# EAGLE design ATMEGA328P (EAGLE 9.5.2)
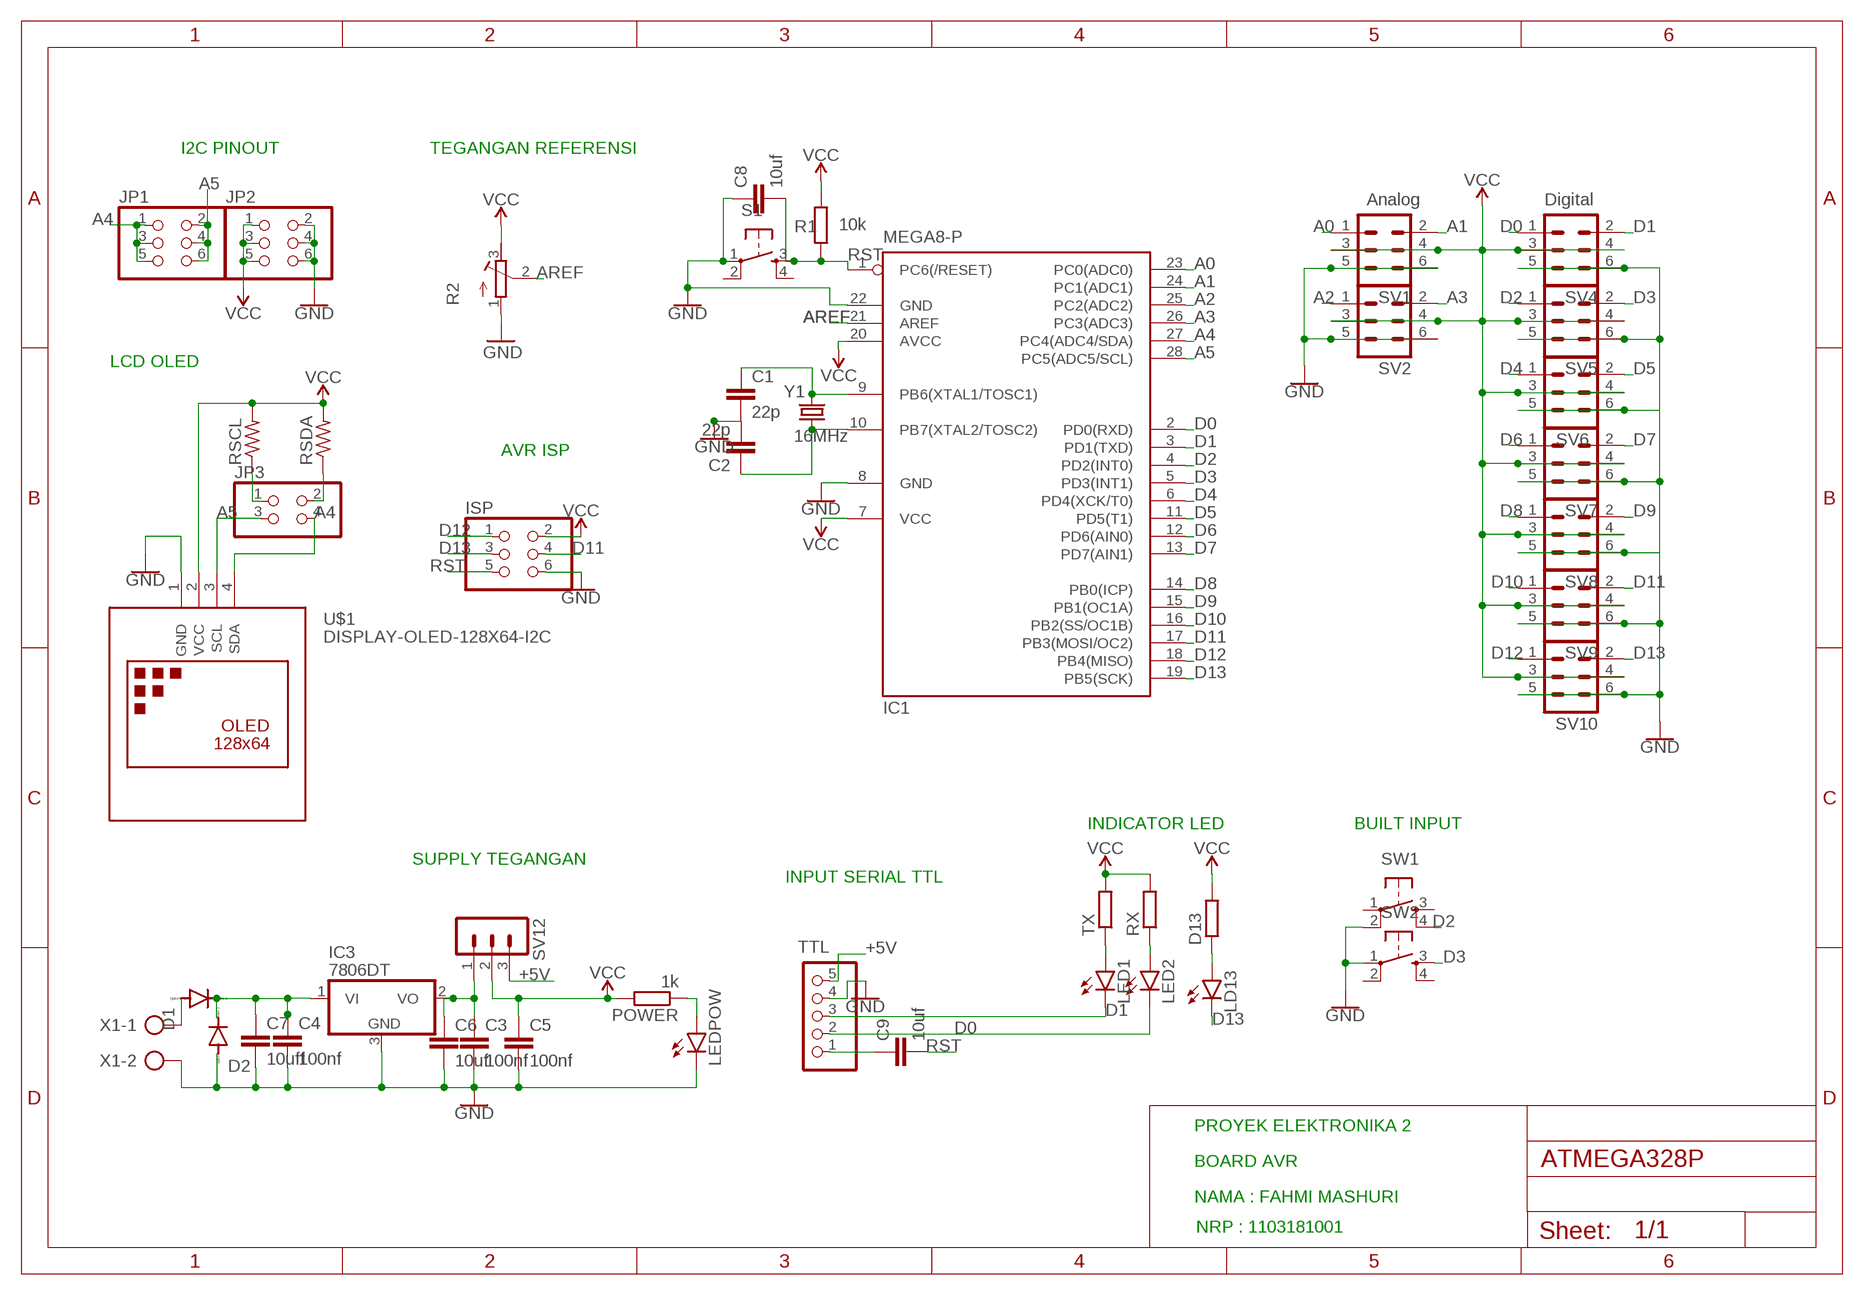
[diagram p0: schematic, sheet 1]

## Parts
C1  22p  C-EUC0805K  [C0805K]
C2  22p  C-EUC0805K  [C0805K]
C3  100nf  C-EUC0805K  [C0805K]
C4  100nf  C-EUC0805K  [C0805K]
C5  100nf  C-EUC0805K  [C0805K]
C6  10uf  C-EUC0805K  [C0805K]
C7  10uff  C-EUC0805K  [C0805K]
C8  10uf  C-EUC0805K  [C0805K]
C9  10uf  C-EUC0805K  [C0805K]
D1  PURPLE  PMLL4150  [SOD80C]
D2  PURPLE  PMLL4150  [SOD80C]
D13  R-EU_R0805  [R0805]
IC1  MEGA8-P  [DIL28-3]
IC3  7806DT  [TO252]
ISP  PINHD-2X3  [2X03]
JP1  PINHD-2X3  [2X03]
JP2  PINHD-2X3  [2X03]
JP3  PINHD-2X2  [2X02]
LD13  LED3MM  [LED3MM]
LED1  LED3MM  [LED3MM]
LED2  LED3MM  [LED3MM]
LEDPOW  LED3MM  [LED3MM]
POWER  1k  R-EU_R0805  [R0805]
R1  10k  R-EU_R0805  [R0805]
R2  R-TRIMM64W  [RTRIM64W]
RSCL  R-US_R1206  [R1206]
RSDA  R-US_R1206  [R1206]
RX  R-EU_R0805  [R0805]
S1  TAC_SWITCHPTH  [TACTILE-PTH]
SV1  MA03-2  [MA03-2]
SV2  MA03-2  [MA03-2]
SV4  MA03-2  [MA03-2]
SV5  MA03-2  [MA03-2]
SV6  MA03-2  [MA03-2]
SV7  MA03-2  [MA03-2]
SV8  MA03-2  [MA03-2]
SV9  MA03-2  [MA03-2]
SV10  MA03-2  [MA03-2]
SV12  MA03-1  [MA03-1]
SW1  TAC_SWITCHPTH  [TACTILE-PTH]
SW2  TAC_SWITCHPTH  [TACTILE-PTH]
TTL  PINHD-1X5  [1X05]
TX  R-EU_R0805  [R0805]
U$1  DISPLAY-OLED-128X64-I2C  [DISPLAY-OLED-128X64-I2C]
X1  AK500/2-H  [AK500/2-H]
Y1  16MHz  CRYSTALSMD-HC49UP  [HC49UP]

## Nets
+5V: SV12.3 TTL.5
A0: IC1.23(PC0(ADC0)) SV1.1
A1: IC1.24(PC1(ADC1)) SV1.2
A2: IC1.25(PC2(ADC2)) SV2.1
A3: IC1.26(PC3(ADC3)) SV2.2
A4: IC1.27(PC4(ADC4/SDA)) JP1.1 JP1.3 JP1.5 JP3.4 U$1.4(SDA)
A5: IC1.28(PC5(ADC5/SCL)) JP1.2 JP1.4 JP1.6 JP3.3 U$1.3(SCL)
AREF: IC1.21(AREF) R2.2(S)
D0: IC1.2(PD0(RXD)) LED2.K(C) SV4.1 TTL.2
D1: IC1.3(PD1(TXD)) LED1.K(C) SV4.2 TTL.3
D2: IC1.4(PD2(INT0)) SV5.1 SW1.4
D3: IC1.5(PD3(INT1)) SV5.2 SW2.3
D4: IC1.6(PD4(XCK/T0)) SV6.1
D5: IC1.11(PD5(T1)) SV6.2
D6: IC1.12(PD6(AIN0)) SV7.1
D7: IC1.13(PD7(AIN1)) SV7.2
D8: IC1.14(PB0(ICP)) SV8.1
D9: IC1.15(PB1(OC1A)) SV8.2
D10: IC1.16(PB2(SS/OC1B)) SV9.1
D11: IC1.17(PB3(MOSI/OC2)) ISP.4 SV9.2
D12: IC1.18(PB4(MISO)) ISP.1 SV10.1
D13: IC1.19(PB5(SCK)) ISP.3 LD13.K(C) SV10.2
GND: C1.2 C2.2 C3.2 C4.2 C5.2 C6.2 C7.2 C8.1 D2.A IC1.8(GND) IC1.22(GND) IC3.3(GND) ISP.6 JP2.2 JP2.4 JP2.6 LEDPOW.K(C) R2.1(A) S1.1 SV1.5 SV1.6 SV2.5 SV2.6 SV4.5 SV4.6 SV5.5 SV5.6 SV6.5 SV6.6 SV7.5 SV7.6 SV8.5 SV8.6 SV9.5 SV9.6 SV10.5 SV10.6 SW1.2 SW2.1 TTL.4 U$1.1(GND) X1.2
N$1: D13.1 LD13.A
N$2: C9.1 TTL.1
N$3: JP3.1 RSCL.1
N$4: JP3.2 RSDA.1
N$5: C1.1 IC1.9(PB6(XTAL1/TOSC1)) Y1.2
N$6: C2.1 IC1.10(PB7(XTAL2/TOSC2)) Y1.1
N$7: D1.A X1.1
N$8: C4.1 C7.1 D1.C D2.C IC3.1(VI)
N$10: LED1.A TX.1
N$11: LED2.A RX.1
N$12: C3.1 C6.1 IC3.2(VO) SV12.1
N$14: LEDPOW.A POWER.1
RST: C8.2 C9.2 IC1.1(PC6(/RESET)) ISP.5 R1.1 S1.3
VCC: C5.1 D13.2 IC1.7(VCC) IC1.20(AVCC) ISP.2 JP2.1 JP2.3 JP2.5 POWER.2 R1.2 R2.3(E) RSCL.2 RSDA.2 RX.2 SV1.3 SV1.4 SV2.3 SV2.4 SV4.3 SV4.4 SV5.3 SV5.4 SV6.3 SV6.4 SV7.3 SV7.4 SV8.3 SV8.4 SV9.3 SV9.4 SV10.3 SV10.4 SV12.2 TX.2 U$1.2(VCC)
Unconnected: S1.2 S1.4 SW1.1 SW1.3 SW2.2 SW2.4

## Notes on the sheet
- I2C PINOUT | TEGANGAN REFERENSI
- Analog | Digital
- LCD OLED
- AVR ISP
- INDICATOR LED | BUILT INPUT
- SUPPLY TEGANGAN
- INPUT SERIAL TTL
- PROYEK ELEKTRONIKA 2
- BOARD AVR
- NAMA : FAHMI MASHURI
- NRP : 1103181001

## Library data of the parts
C1-C9 = rcl:C-EU: CAPACITOR, European symbol; SPICEPREFIX: C
D1 D2 = diode:PMLL4150: DIODE high speed
D13 POWER R1 RX TX = rcl:R-EU_: RESISTOR, European symbol; SPICEPREFIX: R
IC1 = atmel:MEGA8-P: MICROCONTROLLER 8 Kbytes FLASH, 1 kbytes SRAM, 512 bytes EEPROM, USART, 4-channel 10 bit ADC, 2-channel 8 bit ADC Pin compatible with Atmega48, ATMega88, ATMega168 Source: avr.lbr; OC_FARNELL: unknown; OC_NEWARK: unknown
IC3 = linear:78*: Positive VOLTAGE REGULATOR Source: http://cache.national.com/ds/LM/LM78L05.pdf http://www.fairchildsemi.com/ds/LM/LM7805.pdf
ISP JP1 JP2 = pinhead:PINHD-2X3: PIN HEADER
JP3 = pinhead:PINHD-2X2: PIN HEADER
LD13 LED1 LED2 LEDPOW = led:LED: LED OSRAM: - CHIPLED LG R971, LG N971, LY N971, LG Q971, LY Q971, LO R971, LY R971 LH N974, LH R974 LS Q976, LO Q976, LY Q976 LO Q996 - Hyper CHIPLED LW Q18S LB Q993, LB Q99A, LB R99A - SideLED LS A670, LO A670, LY A670, LG A670, LP A670 LB A673, LV A673, LT A673, LW A673 LH A674 LY A675 LS A676, LA A676, LO A676, LY A676, LW A676 LS A679, LY A679, LG A679 - Hyper Micro SIDELED® LS Y876, LA Y876, LO Y876, LY Y876 LT Y87S - SmartLED LW L88C, LW L88S LB L89C, LB L89S, LG L890 LS L89K, LO L89K, LY L89K LS L896, LA L896, LO L896, LY L896 - TOPLED LS T670, LO T670, LY T670, LG T670, LP T670 LSG T670, LSP T670, LSY T670, LOP T670, LYG T670 LG T671, LOG T671, LSG T671 LB T673, LV T673, LT T673, LW T673 LH T674 LS T676, LA T676, LO T676, LY T676, LB T676, LH T676, LSB T676, LW T676 LB T67C, LV T67C, LT T67C, LS T67K, LO T67K, LY T67K, LW E67C LS E67B, LA E67B, LO E67B, LY E67B, LB E67C, LV E67C, LT E67C LW T67C LS T679, LY T679, LG T679 LS T770, LO T770, LY T770, LG T770, LP T770 LB T773, LV T773, LT T773, LW T773 LH T774 LS E675, LA E675, LY E675, LS T675 LS T776, LA T776, LO T776, LY T776, LB T776 LHGB T686 LT T68C, LB T68C - Hyper Mini TOPLED® LB M676 - Mini TOPLED Santana® LG M470 LS M47K, LO M47K, LY M47K Source: http://www.osram.convergy.de LUXEON: - LUMILED® LXK2-PW12-R00, LXK2-PW12-S00, LXK2-PW14-U00, LXK2-PW14-V00 LXK2-PM12-R00, LXK2-PM12-S00, LXK2-PM14-U00 LXK2-PE12-Q00, LXK2-PE12-R00, LXK2-PE12-S00, LXK2-PE14-T00, LXK2-PE14-U00 LXK2-PB12-K00, LXK2-PB12-L00, LXK2-PB12-M00, LXK2-PB14-N00, LXK2-PB14-P00, LXK2-PB14-Q00 LXK2-PR12-L00, LXK2-PR12-M00, LXK2-PR14-Q00, LXK2-PR14-R00 LXK2-PD12-Q00, LXK2-PD12-R00, LXK2-PD12-S00 LXK2-PH12-R00, LXK2-PH12-S00 LXK2-PL12-P00, LXK2-PL12-Q00, LXK2-PL12-R00 Source: www.luxeon.com KINGBRIGHT: KA-3528ASYC Source: www.kingbright.com
R2 = rcl:R-TRIMM: Trimm resistor; SPICEMODEL: X; SPICEPREFIXL: POT
RSCL RSDA = rcl:R-US_: RESISTOR, American symbol; SPICEPREFIX: R
S1 SW1 SW2 = SparkFun-Retired:TAC_SWITCH: Momentary Switch Button commonly used for reset or general input. Spark Fun Electronics SKU : COM-00097 SMT- SWCH-08247
SV1 SV2 SV4-SV10 = con-lstb:MA03-2: PIN HEADER; OC_FARNELL: unknown; OC_NEWARK: unknown
SV12 = con-lstb:MA03-1: PIN HEADER; OC_FARNELL: unknown; OC_NEWARK: unknown
TTL = pinhead:PINHD-1X5: PIN HEADER
U$1 = oled lcd:DISPLAY-OLED-128X64-I2C: 128x64 Dot Matrix OLED Module based on SSD1306 chip Variant with I2C interface More details available here: http://www.instructables.com/id/Monochrome-096-i2c-OLED-display-with-arduino-SSD13/ SSD1306 datasheet: https://cdn-shop.adafruit.com/datasheets/SSD1306.pdf Click here to find device on ebay.com <http://www.ebay.com/sch/oled+display+128x64+iic> Note: There are two variants: I2C and SPI. Search for the proper version.
X1 = con-ptr500:AK500/2-H: CONNECTOR Aug. 2004 / PTR Meßtechnik: Die Bezeichnung der Serie AK505 wurde geändert. Es handelt sich hierbei um AK500 in horizontaler Ausführung.; OC_FARNELL: unknown; OC_NEWARK: unknown
Y1 = SparkFun-Clocks:CRYSTAL: Crystals (Generic) These are passive quartz crystals, which can be used as a clock source for a microcontroller. Crystal's are two-terminal devices. They require external "load" capacitors to generate an oscillating signal.

## Board
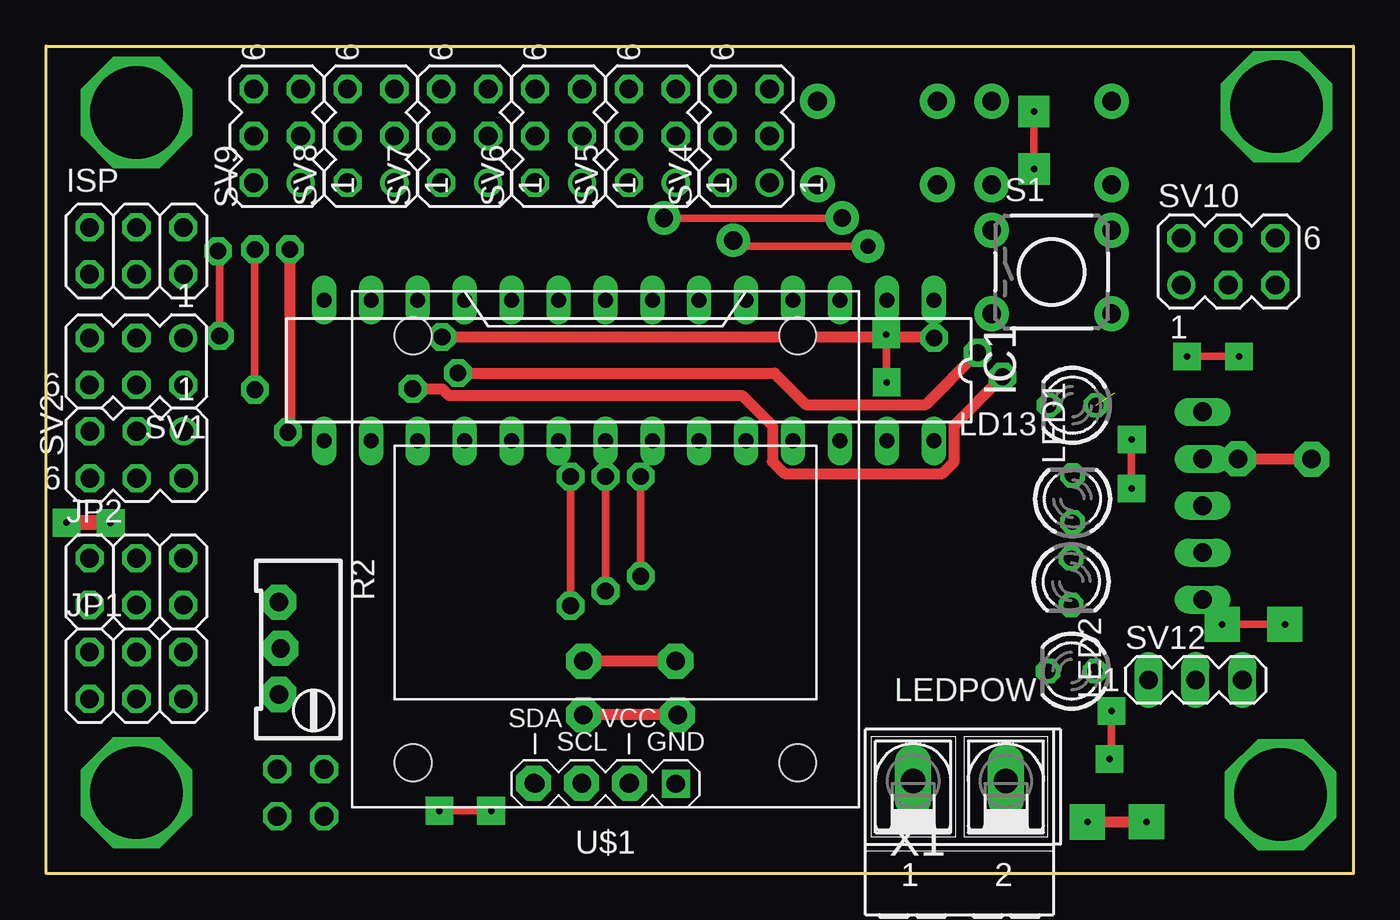
[diagram p1: board, top side]
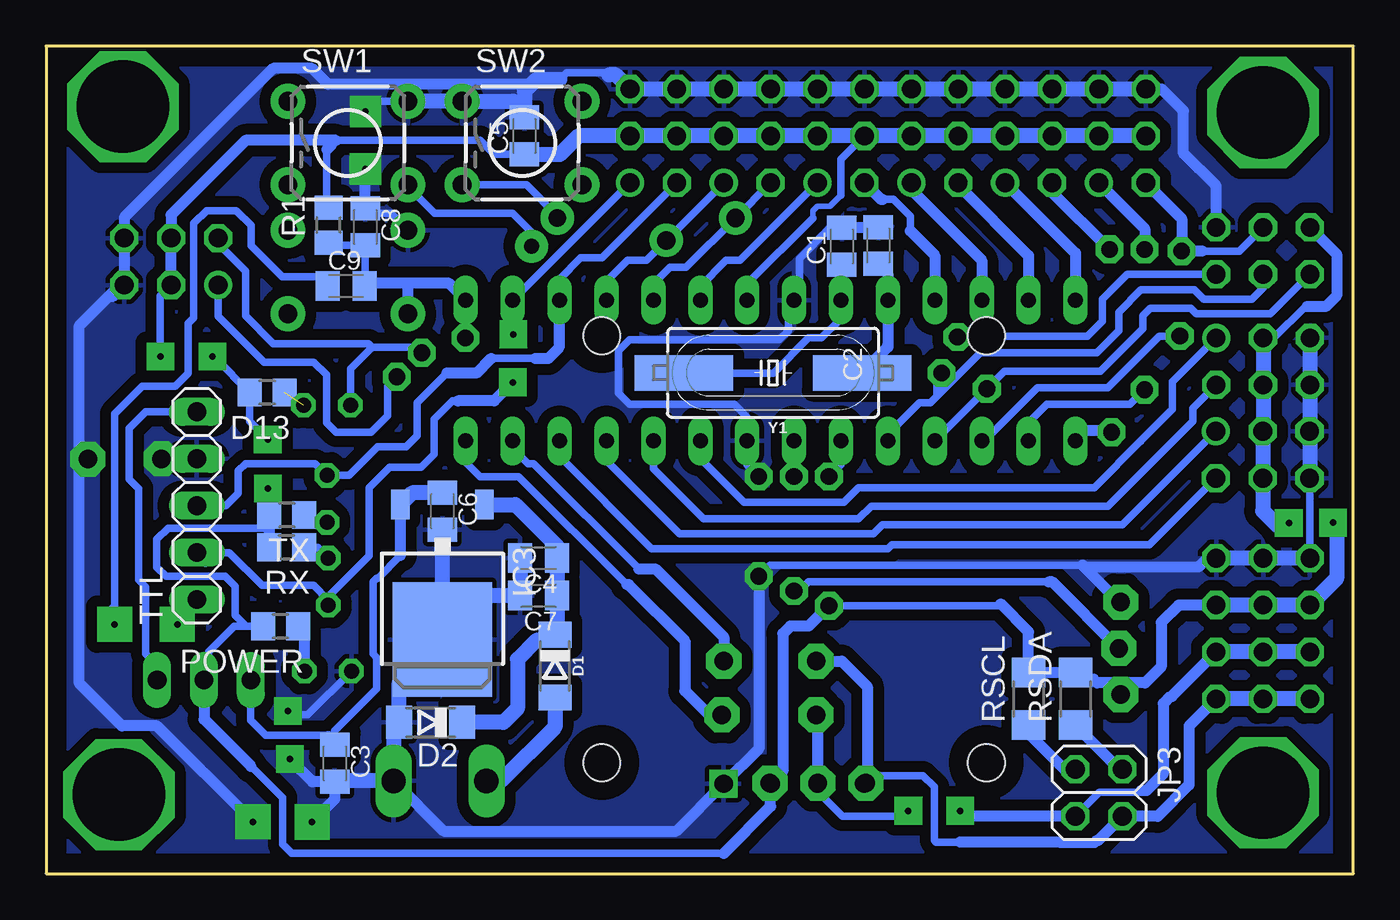
[diagram p2: board, bottom side, seen from below]

Size 70.8 x 44.8 mm. Coordinates in mm from the lower left corner, seen from the top.
Outline: 0,44.8 70.8,44.8 70.8,0 0,0 0,44.8
Copper layers (1*16): Top 0.035mm / dielectric 1.5mm / Bottom 0.035mm
Design rules "default": minimum track width 6mil, minimum drill 0.35mm, track to track 6mil, track to pad 6mil, pad to pad 6mil, via to via 6mil, smd to smd 6mil, copper to edge 40mil, drill to drill 6mil, minimum pad ring 10mil, minimum via ring 8mil, stop-mask expansion 4mil, vias tented up to drill 0mil, thermal gap 10mil

### Footprints (pad centres in the part's own frame; a part is rotated, then mirrored left to right if it is on the bottom)
C0805K = smd 1.3 x 1.6: 1 -1,0; 2 1,0
SOD80C = smd 1.4 x 1.8: A 1.7,0; C -1.7,0
R0805 = smd 1.3 x 1.5: 1 -0.95,0; 2 0.95,0
DIL28-3 = drill 0.813 long: 1 -16.51,-3.81; 2 -13.97,-3.81; 3 -11.43,-3.81; 4 -8.89,-3.81; 5 -6.35,-3.81; 6 -3.81,-3.81; 7 -1.27,-3.81; 8 1.27,-3.81; 9 3.81,-3.81; 10 6.35,-3.81; 11 8.89,-3.81; 12 11.43,-3.81; 13 13.97,-3.81; 14 16.51,-3.81; 15 16.51,3.81; 16 13.97,3.81; 17 11.43,3.81; 18 8.89,3.81; 19 6.35,3.81; 20 3.81,3.81; 21 1.27,3.81; 22 -1.27,3.81; 23 -3.81,3.81; 24 -6.35,3.81; 25 -8.89,3.81; 26 -11.43,3.81; 27 -13.97,3.81; 28 -16.51,3.81
TO252 = smd 1 x 1.6: 1 -2.28,-4.8; 2 2.28,-4.8 | smd 5.4 x 6.2: 3 0,2.5
2X03 = drill 1.016 octagon: 1 -2.54,-1.27; 2 -2.54,1.27; 3 0,-1.27; 4 0,1.27; 5 2.54,-1.27; 6 2.54,1.27
2X02 = drill 1.016 octagon: 1 -1.27,-1.27; 2 -1.27,1.27; 3 1.27,-1.27; 4 1.27,1.27
LED3MM = drill 0.813 octagon: A -1.27,0; K 1.27,0
RTRIM64W = drill 0.61: 1 1.27,-2.54; 2 1.27,0; 3 1.27,2.54
R1206 = smd 1.6 x 1.803: 1 -1.422,0; 2 1.422,0
TACTILE-PTH = drill 1.016 pad 1.88: 1 -3.251,2.261; 2 3.251,2.261; 3 -3.251,-2.261; 4 3.251,-2.261
MA03-2 = drill 1.016: 1 -2.54,-1.27 | drill 1.016 octagon: 2 -2.54,1.27; 3 0,-1.27; 4 0,1.27; 5 2.54,-1.27; 6 2.54,1.27
MA03-1 = drill 1.016 long: 1 -2.54,0; 2 0,0; 3 2.54,0
1X05 = drill 1.016 long: 1 -5.08,0; 2 -2.54,0; 3 0,0; 4 2.54,0; 5 5.08,0
DISPLAY-OLED-128X64-I2C = drill 1 square: 1 -3.81,12.7 | drill 1: 2 -1.27,12.7; 3 1.27,12.7; 4 3.81,12.7 | hole 2: -10.414,11.557; 10.414,11.557; 10.414,-11.557; -10.414,-11.557
AK500/2-H = drill 1.321 long: 1 -2.515,0; 2 2.515,0
HC49UP = smd 5.334 x 1.93: 1 -4.826,0; 2 4.826,0

### Placement (x,y rotation side)
C1  27.7,33.96 90 bottom
C2  25.73,34.01 90 bottom
C3  55.16,5.97 270 bottom
C4  44.13,17.08 180 bottom
C5  44.9,39.94 90 bottom
C6  49.34,19.62 270 bottom
C7  44.13,15.05 180 bottom
C8  53.51,35.01 270 bottom
C9  54.56,31.81 0 bottom
D1  43.24,11.24 270 bottom
D2  49.98,8.19 180 bottom
D13  58.83,26.05 180 bottom
IC1  31.56,27.24 180 top
IC3  49.34,15.18 180 bottom
ISP  4.89,33.72 0 top
JP1  4.89,10.73 0 top
JP2  4.89,15.81 0 top
JP3  13.78,4.38 270 bottom
LD13  55.59,25.36 180 top
LED1  55.59,20.29 90 top
LED2  55.51,15.81 270 top
LEDPOW  55.54,10.96 180 top
POWER  58.11,13.39 180 bottom
R1  55.5,35.11 90 bottom
R2  13.91,12.13 180 top
RSCL  17.59,9.46 90 bottom
RSDA  15.05,9.46 90 bottom
RX  57.78,17.67 180 bottom
S1  54.46,32.57 0 top
SV1  4.89,27.73 180 top
SV2  4.91,22.68 180 top
SV4  37.91,39.94 90 top
SV5  32.83,39.94 90 top
SV6  27.75,39.94 90 top
SV7  22.67,39.94 90 top
SV8  17.59,39.94 90 top
SV9  12.51,39.94 90 top
SV10  64.03,33.14 0 top
SV12  62.25,10.49 0 top
SW1  54.46,39.56 0 bottom
SW2  45.02,39.56 0 bottom
TTL  62.64,19.92 90 bottom
TX  57.77,19.41 180 bottom
U$1  30.29,17.57 180 top
X1  49.47,5.02 0 top
Y1  31.43,27.11 180 bottom

### Tracks (layer width: path | path; a pad name or v marks a point on that pad's centre or on a via)
+5V
  Bottom 0.4: TTL.5 65.4,25 66.3,24.1 66.3,21.35 65.8,20.85 65.8,15.9 65.4,15.5 65.4,11.9 64.79,11.29 SV12.3
A0
  Bottom 0.4: 11.5,23.43 11.5,23.4 | SV1.1 9.8,26.63 9.8,25.13 11.5,23.43 | 11.5,23.43 14.03,20.9 26.8,20.9 27.6,20.1 33,20.1 35.37,22.47 IC1.23
A1
  Bottom 0.4: SV1.2 8.7,25.19 8.7,24.5 13.3,19.9 26.1,19.9 26.8,19.2 35.2,19.2 37.91,21.91 IC1.24
A2
  Bottom 0.4: SV2.1 12.5,18.9 25.5,18.9 26,18.4 36.5,18.4 40.5,22.4 40.5,23.38 IC1.25
A3
  Bottom 0.4: SV2.2 11.06,17.8 25,17.8 25.2,17.6 38,17.6 43,22.6 IC1.26
A4  (via drill 1 pad 1.9)
  Top 0.6: v34.1,11.5 v29.1,11.5
  Bottom 0.4: IC1.27 45.53,23.03 44.7,22.2 44.4,22.2 38.7,16.5 | 13.9,1.8 14,1.7 14,1.6 15.9,1.6 16,1.7 | 21.3,1.7 22.6,1.7 22.7,1.8 22.7,4.7 23.3,5.3 26.05,5.3 26.32,5.03 U$1.4
  Bottom 0.6: JP1.5 8.9,7.99 8.9,4.8 10.6,3.1 JP3.4 13.82,1.8 13.9,1.8 | 16,1.7 21.3,1.7 | v34.1,11.5 34.1,12.8 37.8,16.5 38.7,16.5 | v29.1,11.5 27.7,11.5 26.32,10.12 26.32,5.03
  Bottom 0.8: JP1.1 JP1.3 JP1.5
A5  (via drill 0.35 pad 1.5, 1 pad 1.9)
  Top 0.4: v24.1,3.4 v21.3,3.4
  Top 0.6: v34.2,8.6 v29.1,8.6
  Bottom 0.4: 11.5,4.5 11.6,4.4 13.76,4.4 JP3.3 | IC1.28 48.07,22.27 47.3,21.5 45.2,21.5 39.34,15.65 | 21.58,3.11 21.01,3.11 v21.3,3.4 | v24.1,3.4 24.4,3.1 27.66,3.1 29.02,4.47 U$1.3
  Bottom 0.6: JP1.6 9.83,9.6 9.9,9.6 10.3,9.2 10.3,5.4 11.2,4.5 11.5,4.5 | 39.34,15.65 39.24,15.65 36.2,12.6 36.2,9.9 34.9,8.6 v34.2,8.6 | JP3.3 21.58,3.11 | v29.1,8.6 29.02,8.53 U$1.3
  Bottom 0.8: JP1.2 JP1.4 JP1.6
AREF  (via drill 0.9 pad 1.5)
  Top 0.4: v30.3,21.5 v30.3,15.3
  Bottom 0.4: IC1.21 v30.29,21.51 v30.3,21.5 | v30.3,15.3 30,15.3 29.5,15.8 16.5,15.8
  Bottom 0.6: R2.2 16.31,15.8 16.5,15.8
D0  (via drill 0.35 pad 1.5)
  Top 0.4: v45.5,29.2 45.5,26.6 v45.53,26.6
  Bottom 0.4: IC1.2 SV4.1 | IC1.2 45.6,30.98 45.6,29.78 | IC1.2 45.53,29.23 v45.5,29.2 | 48.5,25.6 48.8,25.6 49.8,24.6 49.8,22.7 50.5,22 52.2,22 53.3,20.9 53.3,17.2 55.51,14.98 55.51,14.8 | 55.51,14.8 LED2.K | TTL.2 60.88,17.38 59.1,15.6 56.32,15.6 55.51,14.8
  Bottom 0.6: 62.16,16.91 TTL.2 | v45.53,26.6 46.53,25.6 48.5,25.6
D1
  Bottom 0.4: SV4.2 40.7,33.34 41.85,33.34 42.99,32.19 IC1.3 | 42.99,28.51 43.6,27.9 | 46.7,27.9 44.3,27.9 | 49.1,27.1 50.7,25.5 50.7,23.7 51.3,23.1 52.85,23.1 54.39,21.56 LED1.K 56.23,22.2 60,22.2 60.4,21.8 60.4,20.6 61.08,19.92 TTL.3
  Bottom 0.6: 49.1,27.1 47.5,27.1 46.7,27.9 | IC1.3 42.99,30.12 43.02,30.08 43.02,28.48 43.6,27.9 44.3,27.9 | 55.69,21.66 LED1.K 55.63,21.6
D2  (via drill 0.8 pad 1.8, 1 pad 1.8)
  Top 0.4: v44.51,33.97 37.53,33.97 v37.21,34.29
  Bottom 0.4: SV5.1 v37.21,34.29 38.29,33.21 39.31,33.21 40.45,32.07 IC1.4 | SW1.4 51.21,37.2 49.76,35.75 45.53,35.75 44.26,34.48 44.26,33.97 v44.51,33.97
D3  (via drill 0.95 pad 1.8, 1 pad 1.8)
  Top 0.4: v43.12,35.5 v33.46,35.5
  Bottom 0.4: SV5.2 v33.46,35.5 36.13,32.83 37.02,32.83 37.91,31.94 IC1.5 | SW2.3 44.79,37.3 43.12,35.62 v43.12,35.5
D4
  Bottom 0.4: SV6.1 33.21,33.21 33.97,33.21 35.37,31.81 IC1.6
D5
  Bottom 0.4: 25.5,36.5 24.9,36.5 24,35.6 24,34.8
  Bottom 0.6: SV6.2 25.58,36.5 25.5,36.5 | 24,34.8 22.67,33.47 IC1.11
D6
  Bottom 0.6: SV7.1 23.94,37.02 20.13,33.21 IC1.12
D7
  Bottom 0.6: SV7.2 21.4,37.27 17.59,33.46 IC1.13
D8
  Bottom 0.6: SV8.1 15.05,33.59 IC1.14
D9  (via drill 0.9 pad 1.5)
  Top 0.6: v13.2,33.8 13.2,23.9 v13.1,23.9
  Bottom 0.6: SV8.2 16.32,36.9 13.22,33.8 v13.2,33.8 | v13.1,23.9 13.2,24 15.1,24 15.1,23.48 IC1.15
D10  (via drill 0.9 pad 1.5)
  Top 0.4: v11.3,33.8 v11.3,26.2
  Bottom 0.4: v11.3,26.2 12.1,25.4 16.6,25.4 17.7,24.3 17.7,23.54 IC1.16
  Bottom 0.6: SV9.1 11.3,34.92 v11.3,33.8
D11  (via drill 0.9 pad 1.5)
  Top 0.4: v9.3,33.7 9.4,33.6 v9.4,29.1
  Bottom 0.4: ISP.4 6.18,33.7 8.2,33.7 | v9.4,29.1 10.5,29.1 13.3,26.3 17.1,26.3 19.97,23.43 IC1.17
  Bottom 0.6: 8.2,33.7 v9.3,33.7 9.3,35.46 SV9.2
D12  (via drill 0.9 pad 1.5)
  Top 0.4: v51.8,26.9 51.45,26.55
  Top 0.6: v19.85,26.25 21.45,26.25 21.8,25.9 37.68,25.9 39.34,24.24 39.34,22.31 39.99,21.66 48.53,21.66 49.18,22.31 49.18,24.28 v51.8,26.9
  Bottom 0.4: ISP.1 4.5,30.3 8.5,30.3 8.8,30.6 11,30.6 11.4,30.2 11.4,29.5 13.7,27.2 18.9,27.2 v19.85,26.25 IC1.18 | v51.8,26.9 52.3,26.4 52.3,24.8 53.2,23.9 55.1,23.9 55.6,24.4 55.6,27 56.3,27.7 59,27.7 61.49,30.19 SV10.1
D13  (via drill 0.9 pad 1.5)
  Top 0.4: 50.05,27.8 v50.45,28.2 | v22.3,27.1 22.7,27.5
  Top 0.6: v22.3,27.1 39.46,27.1 41.16,25.4 47.65,25.4 v50.45,28.2
  Bottom 0.4: ISP.3 4.89,31.71 5.5,31.1 8.1,31.1 8.6,31.6 11.5,31.6 12.7,30.4 12.7,29.4 13.9,28.2 20.2,28.2 22.55,25.85 | IC1.19 25.21,23.79 23.5,25.5 22.9,25.5 22.55,25.85 | 22.55,25.85 22.55,26.85 v22.3,27.1 | 50.7,28.2 v50.45,28.2 50.76,28.51 53.15,28.51 | 53.15,28.51 54.32,27.34 LD13.K | SV10.2 61.49,34.11 60,32.62 60,30.2 58.5,28.7 53.34,28.7 53.15,28.51
GND  (via drill 0.35 pad 1.5, 0.35 pad 1.7, 0.35 pad 1.9, 0.9 pad 1.5, 1 pad 1.9)
  Top 0.4: v32.2,21.5 v32.2,16.1 | v53.5,41.25 v53.5,38.15 | v57.6,6.2 57.7,6.3 v57.7,8.8 | 68.56,22.46 v68.54,22.44
  Top 0.6: v64.56,22.46 68.56,22.46 | v56.4,2.8 59.5,2.8 v59.6,2.8
  Bottom 0.4: 30.29,31.29 IC1.8 | 30.15,30.91 IC1.8 | S1.1 52.12,35.75 52.95,35.75 53.5,36.3 | 40.32,43.24 40.45,43.24 40.58,43.37 42.61,43.37 42.99,42.99 | IC1.8 30,31.34 30,33.3 28.34,34.96 27.4,34.96 | IC1.8 30.6,30.74 30.6,29.4 31.1,28.9 39.2,28.9 39.8,28.3 39.8,26 39.2,25.4 33.53,25.4 32.83,24.7 IC1.22 32.83,22.13 v32.2,21.5 | SV2.6 2.37,17.1 JP2.2 | v32.2,16.1 31.6,16.7 14.67,16.7 14.59,16.62 R2.1 | SW1.2 52.93,41.82 v53.5,41.25 | 54.57,10.96 LEDPOW.K 56.63,8.6 57.7,8.6 v57.7,8.8 | 57.55,6.15 v57.6,6.2
  Bottom 0.6: C2.2 25.78,34.96 27.4,34.96 C1.2 | JP2.6 7.92,17.08 8.4,16.6 14.57,16.6 14.59,16.62 | ISP.6 7.43,37.23 9.2,39 9.2,41.3 10.38,42.48 SV9.6 | TTL.4 v64.56,22.46 64.6,22.5 | 67.2,31.24 SV10.5 66.57,32.1 | 66.57,32.1 SV10.6 66.57,35.53 58.5,43.6 56.4,43.6 55.53,42.73 44.51,42.73 | 57.55,6.15 56.37,4.97 C3.2 55.16,4.03 v56.4,2.8 | v32.2,16.1 32.2,6.77 U$1.1 36.67,2.3 49.27,2.3 X1.2 | v59.6,2.8 64.8,8 66.7,8 69,10.3 69,22.6 | 66.57,32.1 69,29.67 69,22.6 | v68.54,22.44 68.7,22.6 69,22.6 | C8.1 53.51,38.13 v53.5,38.15 | R2.1 14.67,16.7
  Bottom 0.8: SV9.6 SV9.5 SV8.6 SV8.5 SV7.6 SV7.5 SV6.6 SV6.5 SV5.6 SV5.5 SV4.6 SV4.5 39.94,43.24 40.32,43.24 | 42.99,42.99 44.26,42.99 44.51,42.73 44.9,42.35 44.9,41.21 | 44.9,41.21 C5.2 | SW1.2 SW2.1 45.51,41.82 44.9,41.21 | IC3.3 51.68,10.34 D2.A 51.98,7.88 X1.2 55.12,5.02 C3.2 | C4.2 C7.2 48.83,15.05 49.34,14.54 IC3.3 | IC3.3 C6.2 | JP2.2 JP2.4 JP2.6 | SV1.5 SV1.6 2.37,26.44 SV2.5 SV2.6
  pour Bottom (isolate 0.6): 0,44.8 0,0 70.8,0 70.8,44.8
N$1  (1 unrouted)
N$2  (via drill 0.35 pad 1.9)
  Top 0.4: v67.1,13.5 v63.7,13.5
  Bottom 0.4: C9.1 56.07,32.32 58.02,32.32 59.7,34 59.7,35.1 60.5,35.9 62.1,35.9 62.8,35.2 62.8,30.1 63.1,29.8 63.1,27.1 63.8,26.4 65.6,26.4 67.1,24.9 67.1,14.5 67.4,14.2 67.4,13.8 v67.1,13.5 | v63.7,13.5 62.64,14.56 TTL.1
N$3
  Bottom 0.6: RSCL.1 17.4,7.85 17.4,7.4 15.65,5.65 JP3.1
N$4
  Bottom 0.6: RSDA.1 12.66,5.65 JP3.2
N$5
  Bottom 0.4: 28.15,30.65 IC1.9 27.8,31 27.8,30 28.8,29 29.5,29 31.4,27.1 36.25,27.1 Y1.2 34.99,27.11
  Bottom 0.6: C1.1 27.7,31.1 IC1.9
N$6
  Bottom 0.4: IC1.10 25.21,29.78
  Bottom 0.6: Y1.1 25.2,28.52 25.2,28.6 25.21,28.61 IC1.10 25.21,32.49 C2.1
N$7
  Bottom 0.8: D1.A 43.24,7.94 46.16,5.02 X1.1
N$8
  Bottom 0.8: D2.C 46.04,8.19 45.28,8.95 45.28,11.62 44.26,12.64 43.55,12.64 D1.C 43.13,13.05 C7.1 C4.1 43.12,17.1 43.12,17.72 45.38,19.98 IC3.1
N$9  (via drill 5 pad 6)
  other vias: 4.89,4.38
N$10
  Bottom 0.6: TX.1 56.43,19.02 LED1.A
N$11
  Bottom 0.4: RX.1 56.1,17.67 LED2.A
N$12
  Bottom 0.4: 51.62,17.21 52.83,16 52.9,16 53.1,15.8 53.1,11.9 52.9,11.7 52.9,10 55.16,7.74 C3.1 55.69,7.5 58.9,7.5 59.71,8.31 SV12.1
  Bottom 0.6: IC3.2 51.62,17.21
  Bottom 0.8: C3.1 55.51,7.32 | C6.1 50.98,20.62 IC3.2
N$13  (via drill 5 pad 6)
  other vias: 66.86,4.28
N$14
  Bottom 0.6: LEDPOW.A 56.81,13.04 POWER.1
N$15  (via drill 5 pad 6)
  other vias: 66.64,41.53
N$16  (via drill 5 pad 6)
  other vias: 4.89,41.21
N$17  (via drill 1 pad 1.9)
  other vias: 12.6,14.7
N$18  (via drill 1 pad 1.9)
  other vias: 12.7,12.2
N$19  (via drill 1 pad 1.9)
  other vias: 12.6,9.7
N$20  (via drill 1 pad 1.9)
  other vias: 26.4,4.9
N$21  (via drill 1 pad 1.9)
  other vias: 29,4.9
N$22  (via drill 1 pad 1.9)
  other vias: 31.6,4.9
RST  (via drill 0.9 pad 1.5)
  Top 0.4: v21.44,29.06 21.47,29.03 | 48.07,29.03 v48.1,29
  Top 0.6: v21.44,29.06 48.04,29.06 v48.1,29
  Bottom 0.4: R1.1 55.35,34.01 C8.2 53.51,31.95 | 53.41,31.95 C9.2 | ISP.5 12.25,32.45 13.6,31.1 13.6,29.9 14.4,29.1 21.4,29.1 v21.44,29.06 | v48.1,29 48.07,29.03 IC1.1
  Bottom 0.6: S1.3 51.21,31.95 | 51.21,31.95 53.41,31.95 53.51,31.95 | IC1.1 48.98,31.95 51.21,31.95
VCC  (via drill 0.35 pad 1.5, 0.9 pad 1.5)
  Top 0.4: v28.4,21.5 v28.4,14.5 | v58.79,20.85 58.79,23.49 v58.8,23.5 | v64.61,28 v61.8,28
  Top 0.8: v1.1,19 1.12,18.98 v3.49,18.98
  Bottom 0.3: 27.75,36.73 28.35,36.13 29.02,36.13 29.27,35.88 29.27,35.5
  Bottom 0.4: SV6.4 27.75,38.67 27.75,36.73 | 29.27,35.5 32.83,31.94 IC1.7 | IC1.20 27.75,22.15 v28.4,21.5 | v28.4,14.5 19.2,14.5 19.1,14.6 | 2.5,30.7 2.6,30.7 4.3,29 SV1.3 | C5.1 46.54,38.94 47.3,39.7 55.1,39.7 55.35,39.45 | 55.6,39.2 55.6,36.16 R1.2 | POWER.2 59.96,13.39 | 59.96,13.39 60.56,13.99 60.56,15.56 61.1,16.1 64.3,16.1 64.8,16.6 64.8,18.1 64.2,18.7 59.03,18.7 58.72,19.01 TX.2 58.91,19.23 | v58.8,23.5 59.78,24.48 D13.2 61.63,27.9 61.7,27.9 v61.8,28 | SV12.2 62,10.74 62,12 60.61,13.39 59.96,13.39 | v64.61,28 64.61,31.28 SV10.3 | 59.7,5.8 58,4.1 58,1.6 57.5,1.1 34.1,1.1
  Bottom 0.6: 13.38,10.33 R2.3 | JP2.5 9.46,14.54 10.4,13.6 10.4,11.2 11.27,10.33 13.38,10.33 | 13.38,10.33 13.88,10.33 14.08,10.53 14.7,10.53 RSDA.2 RSCL.2 17.59,13.09 19.1,14.6 | ISP.2 0.9,33.54 0.9,31.3 1.5,30.7 2.5,30.7 | 58.91,19.23 58.73,19.05 RX.2 | v58.79,20.85 58.72,20.78 TX.2 | v28.4,14.5 29.5,13.4 30.5,13.4 30.9,13 30.9,5.53 U$1.2 31.57,3.64 34.1,1.1 | SV12.2 62.25,8.35 59.7,5.8 | 55.6,39.2 55.35,39.45 | 55.1,39.7 60,39.7 64.03,35.67 SV10.4 SV10.3
  Bottom 0.8: SV9.4 SV9.3 SV8.4 SV8.3 SV7.4 SV7.3 SV6.4 SV6.3 SV5.4 SV5.3 SV4.4 SV4.3 41.97,39.94 42.99,38.92 44.88,38.92 C5.1 | JP2.5 JP2.3 JP2.1 0.9,15.99 0.9,18.8 v1.1,19 | v3.49,18.98 3.62,18.86 4.13,18.86 4.91,19.64 SV2.4 SV2.3 4.89,23.97 SV1.4 SV1.3